# Altium schematic sheet Control_Board_PowerSwitch.SchDoc
size A3
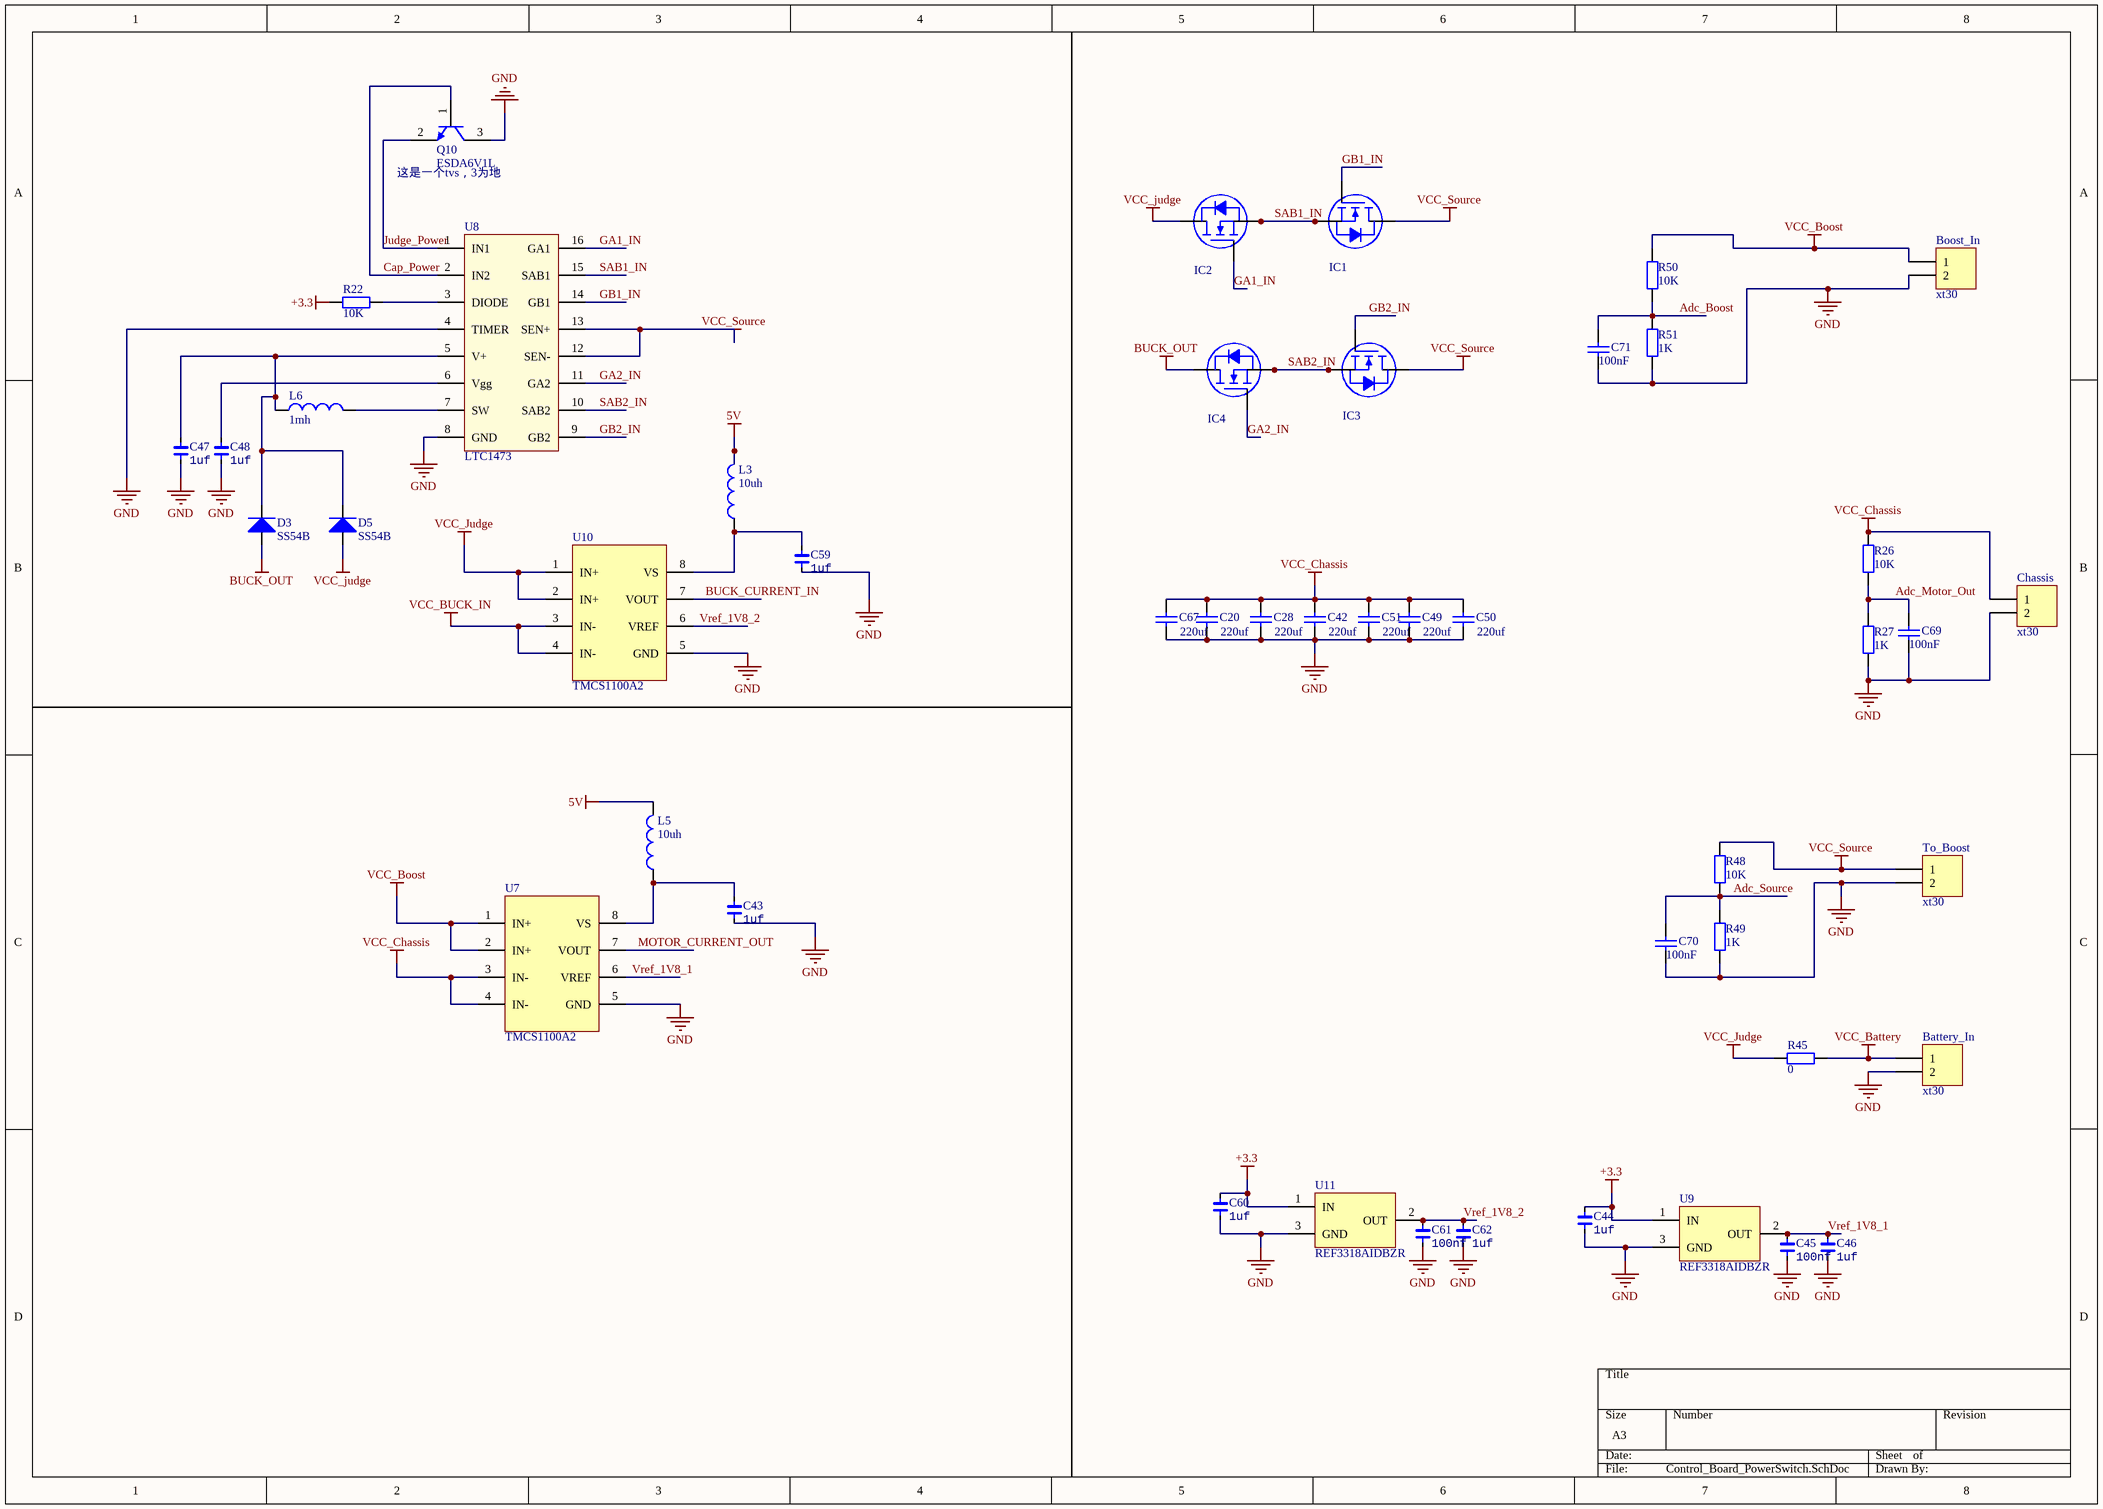
[diagram p0: Control_Board_PowerSwitch.SchDoc]

## Parts
Battery_In  xt30  [XT30-M]
Boost_In  xt30  [XT30-M]
C20  220uf  [1210]
C28  220uf  [1210]
C42  220uf  [1210]
C43  1uf  [c0402]
C44  1uf  [c0402]
C45  100nf  [c0402]
C46  1uf  [c0402]
C47  1uf  [c0402]
C48  1uf  [c0402]
C49  220uf  [1210]
C50  220uf  [1210]
C51  220uf  [1210]
C59  1uf  [c0402]
C60  1uf  [c0402]
C61  100nf  [c0402]
C62  1uf  [c0402]
C67  220uf  [1210]
C69  100nF  [r0402]
C70  100nF  [r0402]
C71  100nF  [r0402]
Chassis  xt30  [XT30-M]
D3  SS54B  [DO-214]
D5  SS54B  [DO-214]
IC1  IPT020N10N3ATMA1  [INFINEON PG-HSOF-8-1]  (value not drawn)
IC2  IPT020N10N3ATMA1  [INFINEON PG-HSOF-8-1]  (value not drawn)
IC3  IPT020N10N3ATMA1  [INFINEON PG-HSOF-8-1]  (value not drawn)
IC4  IPT020N10N3ATMA1  [INFINEON PG-HSOF-8-1]  (value not drawn)
L3  10uh  [l0805]
L5  10uh  [l0805]
L6  1mh  [CD43NP]
Q10  ESDA6V1L  [SOT-23]
R22  10K  [r0402]
R26  10K  [r0402]
R27  1K  [r0402]
R45  value 0  [2512]  (hidden comment: 0.002)
R48  10K  [r0402]
R49  1K  [r0402]
R50  10K  [r0402]
R51  1K  [r0402]
To_Boost  xt30  [XT30-M]
U7  TMCS1100A2  [SOIC8_N]
U8  LTC1473  [16P 0.635mm SSOP]
U9  REF3318AIDBZR  [sot23-3]
U10  TMCS1100A2  [SOIC8_N]
U11  REF3318AIDBZR  [sot23-3]

## Nets
5V: L3.2 L5.2
+3.3: C44.2 C60.2 R22.2 U9.1(IN) U11.1(IN)
BUCK_OUT: D3.1(A) IC4.9(D)
GND: Battery_In.2 Boost_In.2 C20.1 C28.1 C42.1 C43.1 C44.1 C45.1 C46.1 C47.1 C48.1 C49.1 C50.1 C51.1 C59.1 C60.1 C61.1 C62.1 C67.1 C69.1 C70.1 C71.1 Chassis.2 Q10.3(C) R27.2 R49.2 R51.2 To_Boost.2 U7.5(GND) U8.4(TIMER) U8.8(GND) U9.3(GND) U10.5(GND) U11.3(GND)
VCC_Battery: Battery_In.1 R45.2
VCC_Boost: Boost_In.1 R50.2 U7.1(IN+) U7.2(IN+)
VCC_BUCK_IN: U10.3(IN-) U10.4(IN-)
VCC_Chassis: C20.2 C28.2 C42.2 C49.2 C50.2 C51.2 C67.2 Chassis.1 R26.2 U7.3(IN-) U7.4(IN-)
VCC_judge: D5.1(A) IC2.9(D) R45.1 U10.1(IN+) U10.2(IN+)
VCC_Source: IC1.9(D) IC3.9(D) R48.2 To_Boost.1 U8.12(SEN-) U8.13(SEN+)
Adc_Boost: C71.2 R50.1 R51.1
Adc_Motor_Out: C69.2 R26.1 R27.1
Adc_Source: C70.2 R48.1 R49.1
BUCK_CURRENT_IN: U10.7(VOUT)
Cap_Power: Q10.1(B) U8.2(IN2)
GA1_IN: IC2.1(G) U8.16(GA1)
GA2_IN: IC4.1(G) U8.11(GA2)
GB1_IN: IC1.1(G) U8.14(GB1)
GB2_IN: IC3.1(G) U8.9(GB2)
Judge_Power: Q10.2(E) U8.1(IN1)
MOTOR_CURRENT_OUT: U7.7(VOUT)
SAB1_IN: IC1.2(S) IC1.3(S) IC1.4(S) IC1.5(S) IC1.6(S) IC1.7(S) IC1.8(S) IC2.2(S) IC2.3(S) IC2.4(S) IC2.5(S) IC2.6(S) IC2.7(S) IC2.8(S) U8.15(SAB1)
SAB2_IN: IC3.2(S) IC3.3(S) IC3.4(S) IC3.5(S) IC3.6(S) IC3.7(S) IC3.8(S) IC4.2(S) IC4.3(S) IC4.4(S) IC4.5(S) IC4.6(S) IC4.7(S) IC4.8(S) U8.10(SAB2)
Vref_1V8_1: C45.2 C46.2 U7.6(VREF) U9.2(OUT)
Vref_1V8_2: C61.2 C62.2 U10.6(VREF) U11.2(OUT)
NetC43_2: C43.2 L5.1 U7.8(VS)
NetC47_2: C47.2 D3.2(K) D5.2(K) L6.1 U8.5(V+)
NetC48_2: C48.2 U8.6(Vgg)
NetC59_2: C59.2 L3.1 U10.8(VS)
NetL6_2: L6.2 U8.7(SW)
NetR22_1: R22.1 U8.3(DIODE)

## Notes on the sheet
- (near Q10) 这是一个tvs，3为地

## Library data of the parts
Battery_In Boost_In Chassis To_Boost = Header 2H: Header, 2-Pin, Right Angle; LatestRevisionDate: 17-Jul-2002; LatestRevisionNote: Re-released for DXP Platform.; Publisher: Altium Limited
C20 C28 C42 C49-C51 C67 C69-C71 = Cap: 无极性电容; Published: 8-Jun-2000; LatestRevisionDate: 17-Jul-2002; LatestRevisionNote: Re-released for DXP Platform.; PackageReference: RAD-0.3; Publisher: Altium Limited
  C20 C28 C42 C49-C51 C67: Value: 220uf
  C69-C71: Value: 100nF
C43-C48 C59-C62 = Cap_0402_1: Capacitor; Specification: X7R 50V; Type: 0402; Manufacturer: *
  C43 C44 C46-C48 C59 C60 C62: Value: 1uf
  C45 C61: Value: 100nf
D3 D5 = Diode: 肖特基二极管; Published: 8-Jun-2000; LatestRevisionDate: 17-Jul-2002; LatestRevisionNote: Re-released for DXP Platform.; PackageVersion: Sep-1996; PackageReference: SMC; Publisher: Altium Limited; PackageDescription: DO-214-AB/SMC; 2 C-Bend Leads; Body 7.9 x 5.9 mm, inc. leads (LxW); Code_JEDEC: DO-214-AB
IC1-IC4 = IPT020N10N3ATMA1: MOSFET N-CH 100V 300A 8HSOF; Manufacturer: Infineon Technologies; Rds On (Max) at Id, Vgs: 2 mOhm @ 150A, 10V; Vgs(th) (Max) at Id: 3.5V @ 272uA; Gate Charge (Qg): 156nC @ 10V; Input Capacitance (Ciss) at Vds: 11200pF @ 50V; Power - Max: 375W; Current Continuous Drain: 300A (Tc); Part Number: IPT020N10N3ATMA1; PartId: 7970; Supplier 1: Digi-Key; Supplier Part Number 1: IPT020N10N3ATMA1TR-ND; ComponentLink1Description: Datasheet; ComponentLink1URL: http://www.infineon.com/dgdl/IPT020N10N3_Rev1.1.pdf?folderId=db3a304313b8b5a60113cee8763b02d7&fileId=db3a30433e9d5d11013e9e58035b0158; ComponentLink2Description: Digi-Key Listing; ComponentLink2URL: http://www.digikey.com/product-detail/en/IPT020N10N3ATMA1/IPT020N10N3ATMA1TR-ND/4571872; Price: 3.3442; Type: MOSFET N-Channel, Metal Oxide; Device Package: 8-PowerSFN; Drain to Source Voltage (Vdss): 100V; Features: Standard
L3 L5 L6 = Inductor: 功率电感; Code_IEC: 1005; Value: 47uH; Published: 8-Jun-2000; LatestRevisionDate: 29-May-2009; LatestRevisionNote: IPC-7351 Footprint Added.; PackageReference: 0402-A; Publisher: Altium Limited; PackageDescription: Chip Inductor; Code_JEITA: 0402
Q10 = SS8050: TVS(l懒得找原理图了); Published: 8-Jun-2000; LatestRevisionDate: 15-Jan-2003; LatestRevisionNote: PCB Footprint 'BCY-W3/D4.7' replaced; DatasheetDocument: 1997; PackageDocument: Sep-1998; PackageReference: TO-92A; Publisher: Altium Limited; Code_JEDEC: TO-92A; ComponentLink1Description: Manufacturer Link; ComponentLink1URL: http://www.fairchildsemi.com/; ComponentLink2Description: Datasheet; ComponentLink2URL: http://www.fairchildsemi.com/ds/2N%2F2N3904.pdf
R22 R26 R27 R45 R48-R51 = Res1: 贴片电阻; Published: 8-Jun-2000; LatestRevisionDate: 17-Jul-2002; LatestRevisionNote: Re-released for DXP Platform.; PackageReference: AXIAL-0.4; Publisher: Altium Limited
  R22 R26 R48 R50: Value: 10K
  R27 R49 R51: Value: 1K
U7 U10 = TMCS1100
U9 U11 = REF33